# Altium project GameBoard_V1I1.PrjPcb (part 2 of 20)

## Sheet [05] - CPU - HDMI, LVDS.SchDoc
size A2; DocumentNumber: 5; SheetNumber: 5; SheetTotal: 32
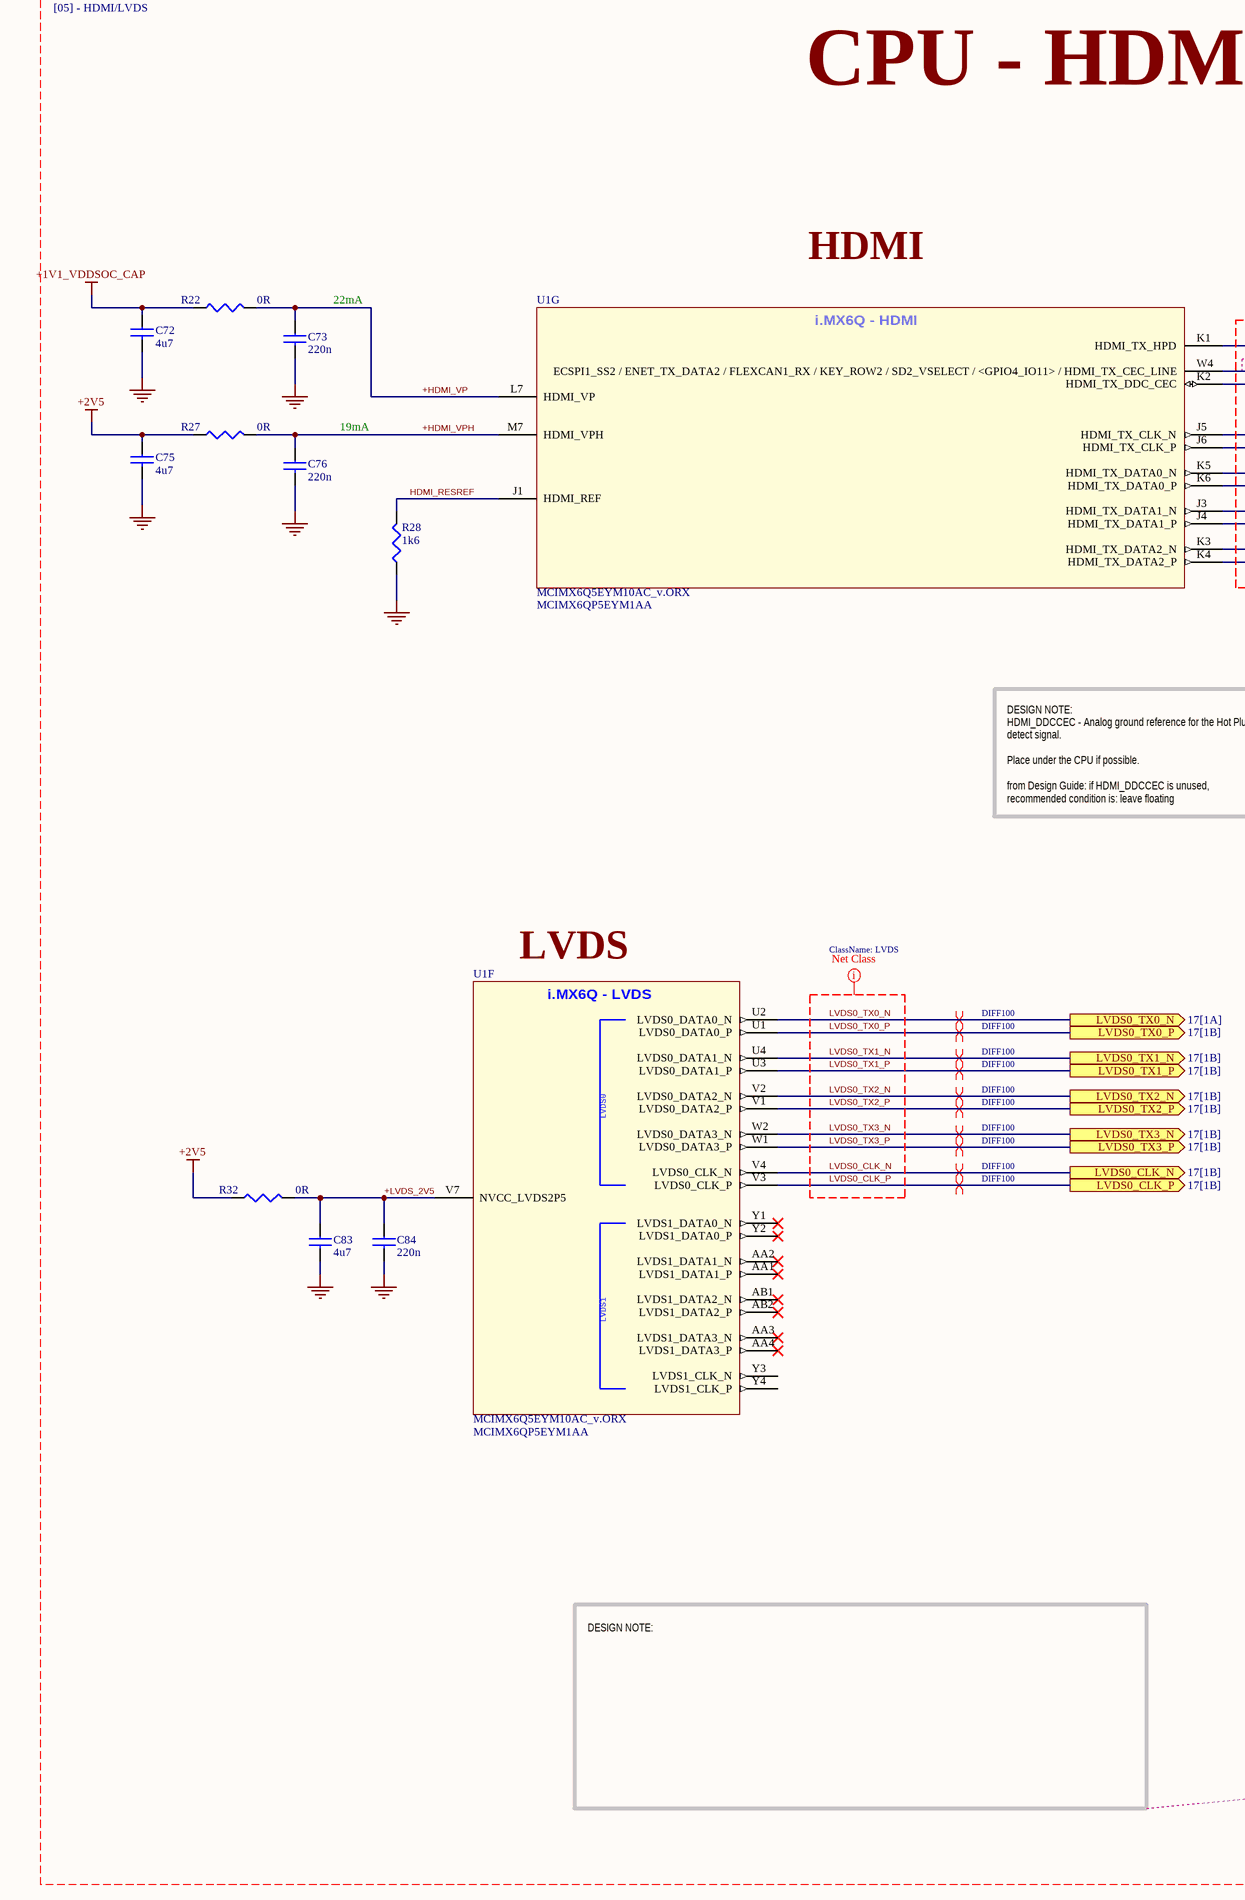
[diagram p12: [05] - CPU - HDMI, LVDS.SchDoc, left]
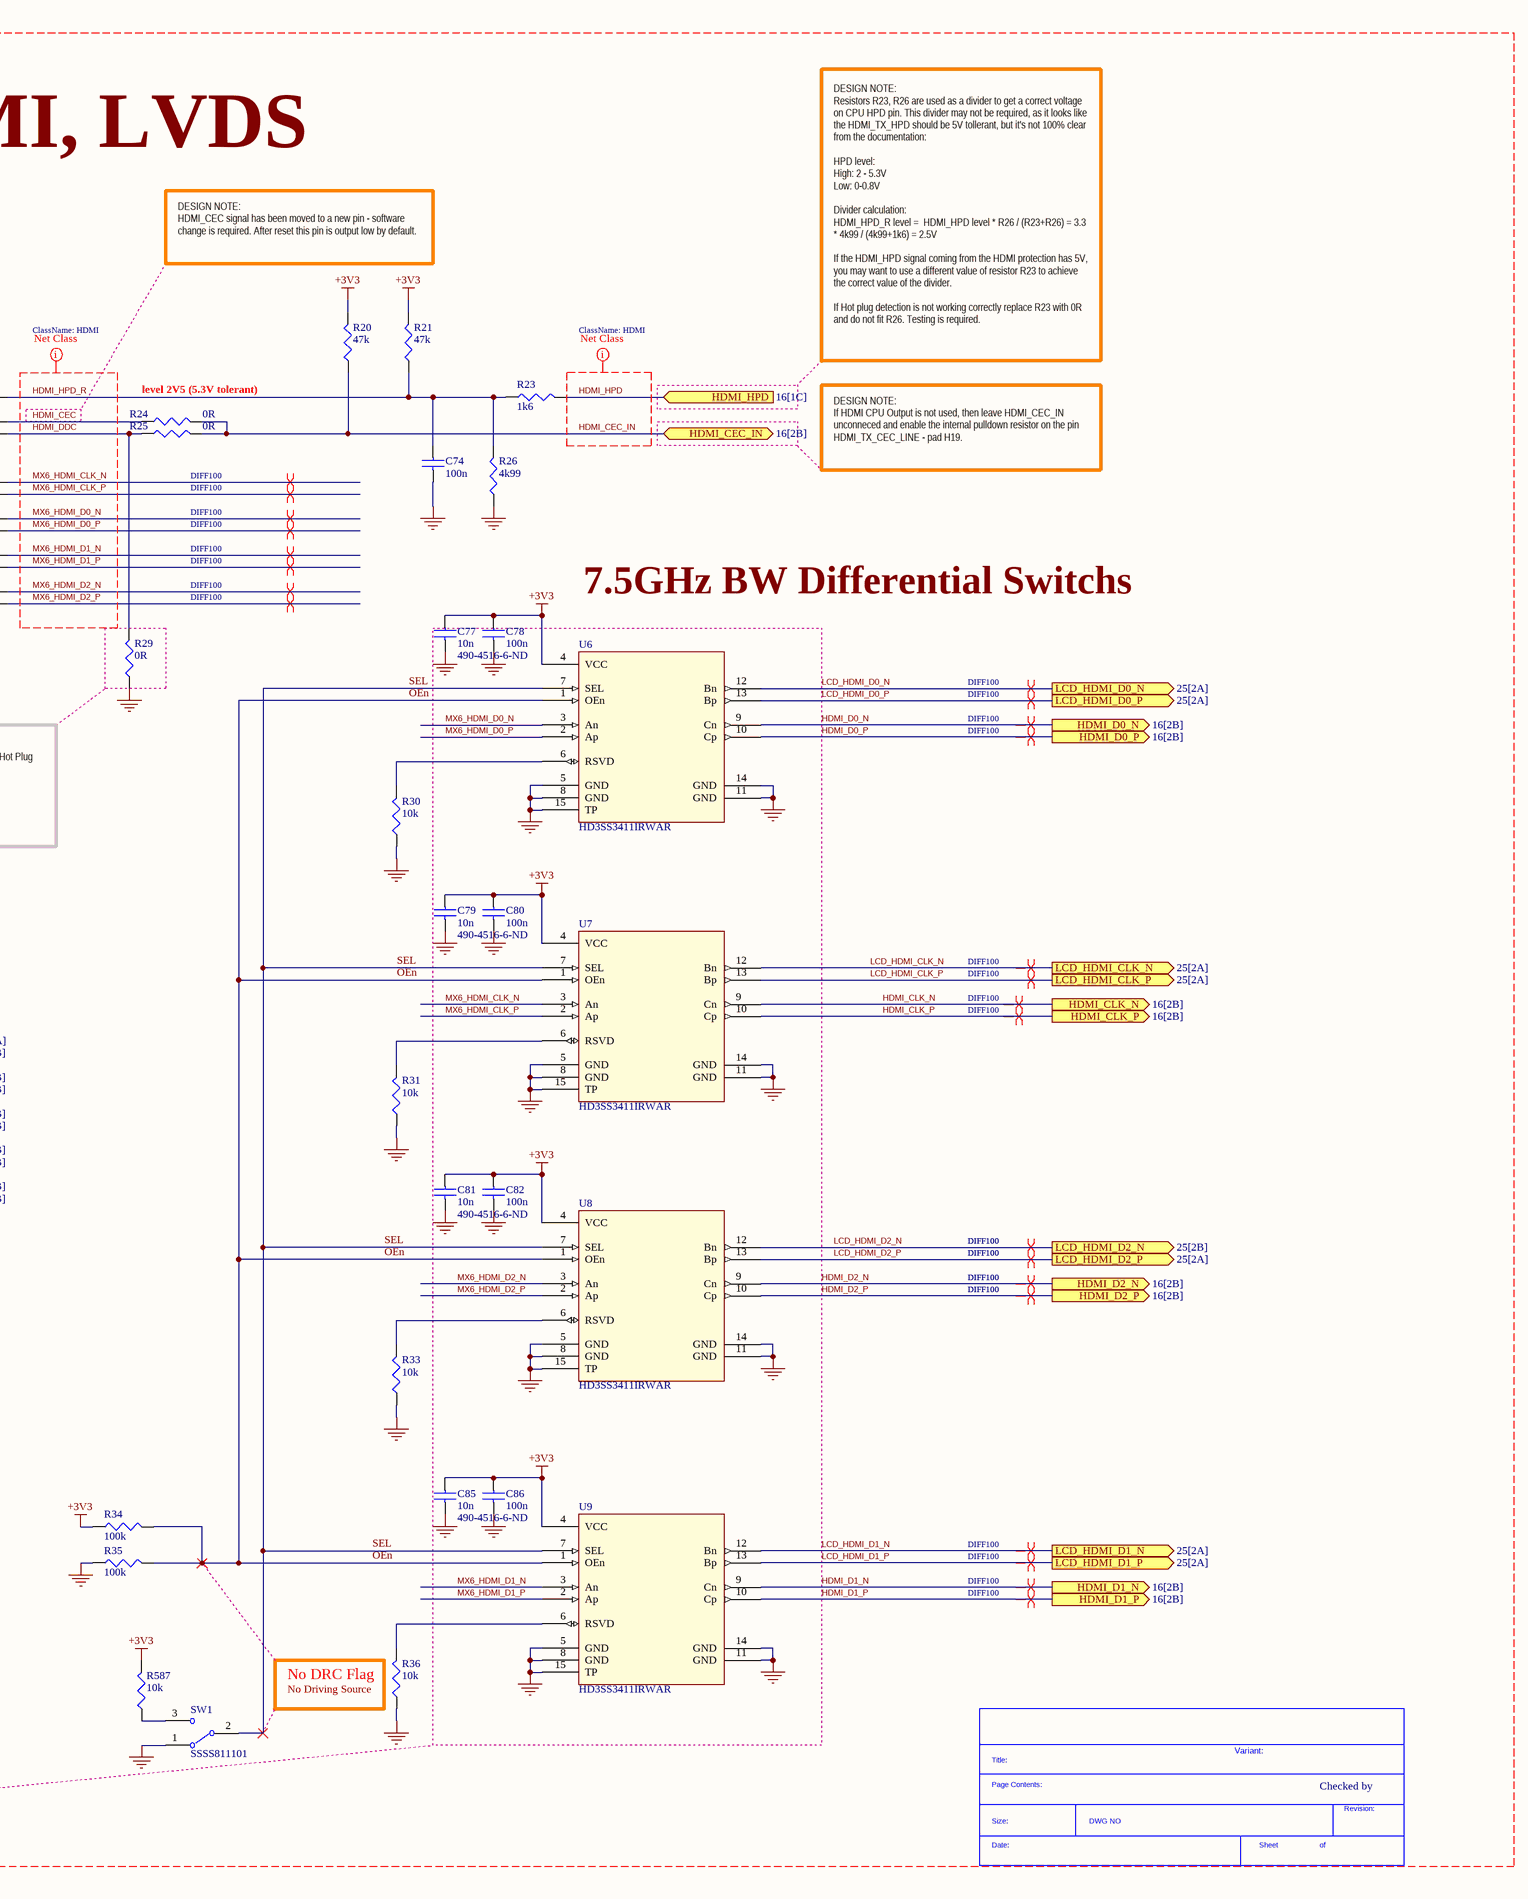
[diagram p13: [05] - CPU - HDMI, LVDS.SchDoc, right]

### Parts
(Parts that share a designator on the sheet are numbered #1, #2 ... from top to bottom, then left to right.)
*#6  SDTitleBlock  (value not drawn)  (graphical)
C72  4u7  [C0402]
C73  220n  [C0201]
C74  100n  [C0402]
C75  4u7  [C0402]
C76  220n  [C0201]
C77  10n  Supplier Part Number 2: 490-4516-6-ND  [C0402]
C78  100n  [C0402]
C79  10n  Supplier Part Number 2: 490-4516-6-ND  [C0402]
C80  100n  [C0402]
C81  10n  Supplier Part Number 2: 490-4516-6-ND  [C0402]
C82  100n  [C0402]
C83  4u7  [C0402]
C84  220n  [C0201]
C85  10n  Supplier Part Number 2: 490-4516-6-ND  [C0402]
C86  100n  [C0402]
R20  47k  [R0402]
R21  47k  [R0402]
R22  0R  [R0402]
R23  1k6  [R0402]
R24  0R  [R0402]
R25  0R  [R0402]
R26  4k99  [R0402]
R27  0R  [R0402]
R28  1k6  [R0201]
R29  0R  [R0402]
R30  10k  [R0201]
R31  10k  [R0201]
R32  0R  [R0402]
R33  10k  [R0201]
R34  100k  [R0402]
R35  100k  [R0402]
R36  10k  [R0201]
R587  10k  [R0201]
SW1  SSSS811101  [SSSS811101]
U1  MCIMX6Q5EYM10AC_v.ORX  Supplier Part Number 2: MCIMX6QP5EYM1AA  [PBGA624]  (parts F,G of 23)
U6  HD3SS3411IRWAR  [QFN50P330X330X80_HS-15N]
U7  HD3SS3411IRWAR  [QFN50P330X330X80_HS-15N]
U8  HD3SS3411IRWAR  [QFN50P330X330X80_HS-15N]
U9  HD3SS3411IRWAR  [QFN50P330X330X80_HS-15N]

### Ports
HDMI_CEC_IN (bidir, see 16[2B]), HDMI_CLK_N (out, see 16[2B]), HDMI_CLK_P (out, see 16[2B]), HDMI_D0_N (out, see 16[2B]), HDMI_D0_P (out, see 16[2B]), HDMI_D1_N (out, see 16[2B]), HDMI_D1_P (out, see 16[2B]), HDMI_D2_N (out, see 16[2B]), HDMI_D2_P (out, see 16[2B]), HDMI_HPD (in, see 16[1C]), LCD_HDMI_CLK_N (out, see 25[2A]), LCD_HDMI_CLK_P (out, see 25[2A]), LCD_HDMI_D0_N (out, see 25[2A]), LCD_HDMI_D0_P (out, see 25[2A]), LCD_HDMI_D1_N (out, see 25[2A]), LCD_HDMI_D1_P (out, see 25[2A]), LCD_HDMI_D2_N (out, see 25[2B]), LCD_HDMI_D2_P (out, see 25[2A]), LVDS0_CLK_N (out, see 17[1B]), LVDS0_CLK_P (out, see 17[1B]), LVDS0_TX0_N (out, see 17[1A]), LVDS0_TX0_P (out, see 17[1B]), LVDS0_TX1_N (out, see 17[1B]), LVDS0_TX1_P (out, see 17[1B]), LVDS0_TX2_N (out, see 17[1B]), LVDS0_TX2_P (out, see 17[1B]), LVDS0_TX3_N (out, see 17[1B]), LVDS0_TX3_P (out, see 17[1B])

### Nets
+1V1_VDDSOC_CAP: C72.1 R22.1
+2V5: C75.1 R27.1 R32.1
+3V3: C77.1 C78.1 C79.1 C80.1 C81.1 C82.1 C85.1 C86.1 R20.2 R21.2 R34.1 R587.2 U6.4(VCC) U7.4(VCC) U8.4(VCC) U9.4(VCC)
GND: C72.2 C73.2 C74.2 C75.2 C76.2 C77.2 C78.2 C79.2 C80.2 C81.2 C82.2 C83.2 C84.2 C85.2 C86.2 R26.1 R28.1 R29.1 R30.1 R31.1 R33.1 R35.1 R36.1 SW1.1 U6.5(GND) U6.8(GND) U6.11(GND) U6.14(GND) U6.15(TP) U7.5(GND) U7.8(GND) U7.11(GND) U7.14(GND) U7.15(TP) U8.5(GND) U8.8(GND) U8.11(GND) U8.14(GND) U8.15(TP) U9.5(GND) U9.8(GND) U9.11(GND) U9.14(GND) U9.15(TP)
+HDMI_VP: C73.1 R22.2 U1.L7(HDMI_VP)
+HDMI_VPH: C76.1 R27.2 U1.M7(HDMI_VPH)
+LVDS_2V5: C83.1 C84.1 R32.2 U1.V7(NVCC_LVDS2P5)
HDMI_CEC: R24.1 U1.W4(ECSPI1_SS2_/_ENET_TX_DATA2_/_FLEXCAN1_RX_/_KEY_ROW2_/_SD2_VSELECT_/_<GPIO4_IO11>_/_HDMI_TX_CEC_LINE)
HDMI_CEC_IN: R20.1 R24.2 R25.2 ; port HDMI_CEC_IN
HDMI_CLK_N: U7.9(Cn) ; port HDMI_CLK_N
HDMI_CLK_P: U7.10(Cp) ; port HDMI_CLK_P
HDMI_D0_N: U6.9(Cn) ; port HDMI_D0_N
HDMI_D0_P: U6.10(Cp) ; port HDMI_D0_P
HDMI_D1_N: U9.9(Cn) ; port HDMI_D1_N
HDMI_D1_P: U9.10(Cp) ; port HDMI_D1_P
HDMI_D2_N: U8.9(Cn) ; port HDMI_D2_N
HDMI_D2_P: U8.10(Cp) ; port HDMI_D2_P
HDMI_DDC: R25.1 R29.2 U1.K2(HDMI_TX_DDC_CEC)
HDMI_HPD: R23.2 ; port HDMI_HPD
HDMI_HPD_R: C74.1 R21.1 R23.1 R26.2 U1.K1(HDMI_TX_HPD)
HDMI_RESREF: R28.2 U1.J1(HDMI_REF)
LCD_HDMI_CLK_N: U7.12(Bn) ; port LCD_HDMI_CLK_N
LCD_HDMI_CLK_P: U7.13(Bp) ; port LCD_HDMI_CLK_P
LCD_HDMI_D0_N: U6.12(Bn) ; port LCD_HDMI_D0_N
LCD_HDMI_D0_P: U6.13(Bp) ; port LCD_HDMI_D0_P
LCD_HDMI_D1_N: U9.12(Bn) ; port LCD_HDMI_D1_N
LCD_HDMI_D1_P: U9.13(Bp) ; port LCD_HDMI_D1_P
LCD_HDMI_D2_N: U8.12(Bn) ; port LCD_HDMI_D2_N
LCD_HDMI_D2_P: U8.13(Bp) ; port LCD_HDMI_D2_P
LVDS0_CLK_N: U1.V4(LVDS0_CLK_N) ; port LVDS0_CLK_N
LVDS0_CLK_P: U1.V3(LVDS0_CLK_P) ; port LVDS0_CLK_P
LVDS0_TX0_N: U1.U2(LVDS0_DATA0_N) ; port LVDS0_TX0_N
LVDS0_TX0_P: U1.U1(LVDS0_DATA0_P) ; port LVDS0_TX0_P
LVDS0_TX1_N: U1.U4(LVDS0_DATA1_N) ; port LVDS0_TX1_N
LVDS0_TX1_P: U1.U3(LVDS0_DATA1_P) ; port LVDS0_TX1_P
LVDS0_TX2_N: U1.V2(LVDS0_DATA2_N) ; port LVDS0_TX2_N
LVDS0_TX2_P: U1.V1(LVDS0_DATA2_P) ; port LVDS0_TX2_P
LVDS0_TX3_N: U1.W2(LVDS0_DATA3_N) ; port LVDS0_TX3_N
LVDS0_TX3_P: U1.W1(LVDS0_DATA3_P) ; port LVDS0_TX3_P
MX6_HDMI_CLK_N: U1.J5(HDMI_TX_CLK_N) U7.3(An)
MX6_HDMI_CLK_P: U1.J6(HDMI_TX_CLK_P) U7.2(Ap)
MX6_HDMI_D0_N: U1.K5(HDMI_TX_DATA0_N) U6.3(An)
MX6_HDMI_D0_P: U1.K6(HDMI_TX_DATA0_P) U6.2(Ap)
MX6_HDMI_D1_N: U1.J3(HDMI_TX_DATA1_N) U9.3(An)
MX6_HDMI_D1_P: U1.J4(HDMI_TX_DATA1_P) U9.2(Ap)
MX6_HDMI_D2_N: U1.K3(HDMI_TX_DATA2_N) U8.3(An)
MX6_HDMI_D2_P: U1.K4(HDMI_TX_DATA2_P) U8.2(Ap)
OEn: R34.2 R35.2 U6.1(OEn) U7.1(OEn) U8.1(OEn) U9.1(OEn)
SEL: SW1.2 U6.7(SEL) U7.7(SEL) U8.7(SEL) U9.7(SEL)
NetR30_2: R30.2 U6.6(RSVD)
NetR31_2: R31.2 U7.6(RSVD)
NetR33_2: R33.2 U8.6(RSVD)
NetR36_2: R36.2 U9.6(RSVD)
NetR587_1: R587.1 SW1.3

Not connected (* = marked no-connect by the designer): U1 AA1(LVDS1_DATA1_P)* AA2(LVDS1_DATA1_N)* AA3(LVDS1_DATA3_N)* AA4(LVDS1_DATA3_P)* AB1(LVDS1_DATA2_N)* AB2(LVDS1_DATA2_P)* Y1(LVDS1_DATA0_N)* Y2(LVDS1_DATA0_P)* Y3(LVDS1_CLK_N) Y4(LVDS1_CLK_P)

### Layout directives
differential pair; net class DIFF100: HDMI_CLK_N, HDMI_CLK_P, HDMI_D0_N, HDMI_D0_P, HDMI_D1_N, HDMI_D1_P, HDMI_D2_N, HDMI_D2_P, LCD_HDMI_CLK_N, LCD_HDMI_CLK_P, LCD_HDMI_D0_N, LCD_HDMI_D0_P, LCD_HDMI_D1_N, LCD_HDMI_D1_P, LCD_HDMI_D2_N, LCD_HDMI_D2_P, LVDS0_CLK_N, LVDS0_CLK_P, LVDS0_TX0_N, LVDS0_TX0_P, LVDS0_TX1_N, LVDS0_TX1_P, LVDS0_TX2_N, LVDS0_TX2_P, LVDS0_TX3_N, LVDS0_TX3_P, MX6_HDMI_CLK_N, MX6_HDMI_CLK_P, MX6_HDMI_D0_N, MX6_HDMI_D0_P, MX6_HDMI_D1_N, MX6_HDMI_D1_P, MX6_HDMI_D2_N, MX6_HDMI_D2_P
net class HDMI: HDMI_CEC, HDMI_CEC_IN, HDMI_DDC, HDMI_HPD, HDMI_HPD_R, MX6_HDMI_CLK_N, MX6_HDMI_CLK_P, MX6_HDMI_D0_N, MX6_HDMI_D0_P, MX6_HDMI_D1_N, MX6_HDMI_D1_P, MX6_HDMI_D2_N, MX6_HDMI_D2_P
net class [05] - HDMI/LVDS: +1V1_VDDSOC_CAP, +2V5, +3V3, +HDMI_VP, +HDMI_VPH, +LVDS_2V5, GND, HDMI_CEC, HDMI_CEC_IN, HDMI_CLK_N, HDMI_CLK_P, HDMI_D0_N, HDMI_D0_P, HDMI_D1_N, HDMI_D1_P, HDMI_D2_N, HDMI_D2_P, HDMI_DDC, HDMI_HPD, HDMI_HPD_R, HDMI_RESREF, LCD_HDMI_CLK_N, LCD_HDMI_CLK_P, LCD_HDMI_D0_N, LCD_HDMI_D0_P, LCD_HDMI_D1_N, LCD_HDMI_D1_P, LCD_HDMI_D2_N, LCD_HDMI_D2_P, LVDS0_CLK_N, LVDS0_CLK_P, LVDS0_TX0_N, LVDS0_TX0_P, LVDS0_TX1_N, LVDS0_TX1_P, LVDS0_TX2_N, LVDS0_TX2_P, LVDS0_TX3_N, LVDS0_TX3_P, MX6_HDMI_CLK_N, MX6_HDMI_CLK_P, MX6_HDMI_D0_N, MX6_HDMI_D0_P, MX6_HDMI_D1_N, MX6_HDMI_D1_P, MX6_HDMI_D2_N, MX6_HDMI_D2_P, OEn, SEL
net class LVDS: LVDS0_CLK_N, LVDS0_CLK_P, LVDS0_TX0_N, LVDS0_TX0_P, LVDS0_TX1_N, LVDS0_TX1_P, LVDS0_TX2_N, LVDS0_TX2_P, LVDS0_TX3_N, LVDS0_TX3_P

### Notes on the sheet
- CPU - HDMI, LVDS
- DESIGN NOTE:
  HDMI_CEC signal has been moved to a new pin - software change is required. After reset this pin is output low by default.
- HDMI
- (near C73) 22mA
- level 2V5 (5.3V tolerant)
- DESIGN NOTE:
  Resistors R23, R26 are used as a divider to get a correct voltage on CPU HPD pin. This divider may not be required, as it looks like the HDMI_TX_HPD should be 5V tollerant, but it's not 100% clear from the documentation:
  HPD level:
  High: 2 - 5.3V
  Low: 0-0.8V
  Divider calculation:
  HDMI_HPD_R level =  HDMI_HPD level * R26 / (R23+R26) = 3.3 * 4k99 / (4k99+1k6) = 2.5V
  If the HDMI_HPD signal coming from the HDMI protection has 5V, you may want to use a different value of resistor R23 to achieve the correct value of the divider.
  If Hot plug detection is not working correctly replace R23 with 0R and do not fit R26. Testing is required.
- DESIGN NOTE:
  If HDMI CPU Output is not used, then leave HDMI_CEC_IN unconneced and enable the internal pulldown resistor on the pin HDMI_TX_CEC_LINE - pad H19.
- 19mA
- 7.5GHz BW Differential Switchs
- DESIGN NOTE:
  HDMI_DDCCEC - Analog ground reference for the Hot Plug detect signal.
  Place under the CPU if possible.
  from Design Guide: if HDMI_DDCCEC is unused, recommended condition is: leave floating
- LVDS
- DESIGN NOTE:
- (near R36) No DRC Flag
- (near R36) No Driving Source
- Variant:
- Checked by
- (in symbol MCIMX6Q5EYM10AC_v.ORX, part F) i.MX6Q - LVDS; LVDS0; LVDS1
- (in symbol MCIMX6Q5EYM10AC_v.ORX, part G) i.MX6Q - HDMI
- (in symbol SDTitleBlock) Title:; Page Contents:; Revision:; Size:; DWG NO; Date:; Sheet; of

### Library data of the parts
C72 C75 C83 = C1005X5R1A475M: as C60 on sheet [04] - CPU - PCIE, USB; Supplier 1: Digi-Key; Supplier Part Number 1: 445-8023-1-ND; Manufacturer Part Number: C1005X5R1A475M; RoHS: RoHS Compliant; Category: Capacitors; Stock 1: 10140; Pricing 1: 1=0.53, 10=0.415, 100=0.25, 250=0.18752, 500=0.16, 1000=0.125, 5000=0.095 (USD); Voltage - Rated: 10V; Tolerance: ±20%; Temperature Coefficient: X5R; Mounting Type: Surface Mount, MLCC; Operating Temperature: -55°C ~ 85°C; Applications: General Purpose; Ratings: -; Package / Case: 0402 (1005 Metric); Size / Dimension: 0.039" L x 0.020" W (1.00mm x 0.50mm); Height - Seated (Max): -; Thickness (Max): -; Lead Spacing: -; Features: -; Packaging: Cut Tape (CT); Lead Style: -; ComponentLink1URL: http://www.tdk.com/pdf/general_B11.pdf; ComponentLink1Description: http://www.tdk.com/pdf/general_B11.pdf; .Checked SCH: used
C73 C76 C84 = C0603X5R0J224M030BB: as C59 on sheet [04] - CPU - PCIE, USB; Supplier 1: Digi-Key; Manufacturer Part Number: C0603X5R0J224M030BB; RoHS: RoHS Compliant; Category: Capacitors; Stock 1: 205900; Pricing 1: 1=0.15, 10=0.102, 100=0.0485, 250=0.0408, 500=0.03418, 1000=0.0275, 5000=0.02325 (USD); Packaging: Cut Tape (CT); Tolerance: ±20%; Voltage - Rated: 6.3V; Temperature Coefficient: X5R; Mounting Type: Surface Mount, MLCC; Operating Temperature: -55°C ~ 85°C; Applications: General Purpose; Ratings: -; Package / Case: 0201 (0603 Metric); Size / Dimension: 0.024" L x 0.012" W (0.60mm x 0.30mm); Height - Seated (Max): -; Thickness (Max): 0.013" (0.33mm); Lead Spacing: -; Features: -; Lead Style: -; ComponentLink1URL: http://product.tdk.com/en/catalog/datasheets/mlcc_commercial_general_en.pdf; ComponentLink1Description: http://product.tdk.com/en/catalog/datasheets/mlcc_commercial_general_en.pdf; Supplier Part Number 1: 445-5929-1-ND; .Checked SCH: used; Supplier 2: Digi-Key; Supplier Part Number 2: 1276-1042-6-ND
C74 C78 C80 C82 C86 = C1005X5R1H104K: as C476 on sheet [17] - LVDS, CSI; Category: Capacitors; Supplier Part Number: 445-5942-1-ND; Manufacturer Part Number: C1005X5R1H104K; Operating Temperature: -55°C ~ 85°C; Package / Case: 0402 (1005 Metric); Price 1k [$]: 0.02340; .Checked SCH: used; Voltage - Rated: 50V; Supplier: Digikey; Supplier 1: Digi-Key; Supplier Part Number 1: 445-5942-1-ND; RoHS: RoHS Compliant; Stock 1: 106926; Pricing 1: 1=0.27, 10=0.18, 100=0.072, 250=0.05176, 500=0.0369, 1000=0.027 (USD); Tolerance: ±10%; Temperature Coefficient: X5R; Mounting Type: Surface Mount, MLCC; Applications: General Purpose; Ratings: -; Size / Dimension: 0.039" L x 0.020" W (1.00mm x 0.50mm); Height - Seated (Max): -; Thickness (Max): 0.022" (0.55mm); Lead Spacing: -; Features: -; Packaging: Cut Tape (CT); Lead Style: -; ComponentLink1URL: http://www.tdk.co.jp/tefe02/e412_c.pdf; ComponentLink1Description: http://www.tdk.co.jp/tefe02/e412_c.pdf; Supplier 2: Digi-Key; Supplier Part Number 2: 311-1697-6-ND
C77 C79 C81 C85 = C1005X7R1H103K: CAP CER 10000PF 50V 10% X7R 0402; Manufacturer: TDK Corporation; Value: 10nF; .Checked PCB: used; Capacitance: 10000pF; Category: Capacitors; Supplier Part Number: 445-6850-1-ND; Manufacturer Part Number: C1005X7R1H103K; Operating Temperature: -55°C ~ 125°C; Package / Case: 0402 (1005 Metric); Price 1k [$]: 0.01625; .Checked SCH: used; Voltage - Rated: 50V; Supplier: Digikey; Supplier 1: Digi-Key; Supplier Part Number 1: 445-6850-1-ND; RoHS: RoHS Compliant; Stock 1: 3901; Pricing 1: 1=0.2, 10=0.125, 100=0.045, 250=0.03252, 500=0.024, 1000=0.01625 (USD); Tolerance: ±10%; Temperature Coefficient: X7R; Mounting Type: Surface Mount, MLCC; Applications: General Purpose; Ratings: -; Size / Dimension: 0.039" L x 0.020" W (1.00mm x 0.50mm); Height - Seated (Max): -; Thickness (Max): 0.022" (0.55mm); Lead Spacing: -; Features: -; Packaging: Cut Tape (CT); Lead Style: -; ComponentLink1URL: http://www.tdk.co.jp/tefe02/e412_c.pdf; ComponentLink1Description: http://www.tdk.co.jp/tefe02/e412_c.pdf; Supplier 2: Digi-Key
R20 R21 = RC0402FR-0747KL: RES 47.0K OHM 1/16W 1% 0402 SMD; Manufacturer: Yageo; Power (Watts): 0.063W, 1/16W; .Checked PCB: used; Temperature Coefficient: ±100ppm/°C; Category: Resistors; Supplier Part Number: 311-47.0KLRCT-ND; Manufacturer Part Number: RC0402FR-0747KL; Package / Case: 0402 (1005 Metric); Price 1k [$]: 0.01421; Resistance (Ohms): 47K; Tolerance: ±1%; Value: 47k; .Checked SCH: used; Supplier: Digikey; Supplier 1: Digi-Key; Supplier Part Number 1: 311-47.0KLRCT-ND; RoHS: RoHS Compliant; Stock 1: 1227580; Pricing 1: 10=0.014, 50=0.0104, 100=0.0079, 250=0.00584, 500=0.00432, 1000=0.00288 (USD); Composition: Thick Film; Features: -; Size / Dimension: 0.039" L x 0.020" W (1.00mm x 0.50mm); Height: 0.016" (0.40mm); Number of Terminations: 2; Packaging: Cut Tape (CT); ComponentLink1URL: http://www.yageo.com/documents/recent/PYu-RC0402_51_RoHS_L_6.pdf; ComponentLink1Description: http://www.yageo.com/documents/recent/PYu-RC0402_51_RoHS_L_6.pdf; Supplier 2: Digi-Key; Supplier Part Number 2: 1276-3467-1-ND
R22 R24 R25 R27 R29 R32 = RC0402JR-070RL: as R443 on sheet [17] - LVDS, CSI; Category: Resistors; Supplier Part Number: 311-0.0JRCT-ND; Manufacturer Part Number: RC0402JR-070RL; Package / Case: 0402 (1005 Metric); Price 1k [$]: 0.01389; Value: 0R; .Checked SCH: used; Supplier: Digikey; Supplier 1: Digi-Key; Supplier Part Number 1: 311-0.0JRCT-ND; RoHS: RoHS Compliant; Stock 1: 1106330; Pricing 1: 10=0.012, 50=0.009, 100=0.0069, 250=0.00512, 500=0.0038, 1000=0.00253 (USD); Composition: Thick Film; Features: -; Temperature Coefficient: -; Size / Dimension: 0.039" L x 0.020" W (1.00mm x 0.50mm); Height: 0.016" (0.40mm); Number of Terminations: 2; Packaging: Cut Tape (CT); ComponentLink1URL: http://www.yageo.com/documents/recent/PYu-RC0402_51_RoHS_L_6.pdf; ComponentLink1Description: http://www.yageo.com/documents/recent/PYu-RC0402_51_RoHS_L_6.pdf
R23 = ERJ-2RKF1601X: RES 1.6K OHM 1/10W 1% 0402 SMD; Manufacturer: Panasonic Electronic Components; Power (Watts): 0.1W, 1/10W; Temperature Coefficient: ±100ppm/°C; .Creator: MM; .Checked PCB: used; Supplier 1: Digi-Key; Manufacturer Part Number: ERJ-2RKF1601X; RoHS: RoHS Compliant; Category: Resistors; Stock 1: 89488; Pricing 1: 1=0.1, 50=0.0242, 100=0.0184, 250=0.01364, 500=0.01008, 1000=0.00672, 5000=0.00473 (USD); Resistance (Ohms): 1.6k; Composition: Thick Film; Features: -; Tolerance: ±1%; Package / Case: 0402 (1005 Metric); Supplier Device Package: 0402; Size / Dimension: 0.039" L x 0.020" W (1.00mm x 0.50mm); Height: 0.016" (0.40mm); Number of Terminations: 2; Packaging: Cut Tape (CT); ComponentLink1URL: http://industrial.panasonic.com/www-cgi/jvcr13pz.cgi?E+PZ+3+AOA0002+ERJ2RKF1601X+7+WW; ComponentLink1Description: http://industrial.panasonic.com/www-cgi/jvcr13pz.cgi?E+PZ+3+AOA0002+ERJ2RKF1601X+7+WW; Supplier Part Number 1: P1.60KLCT-ND; .Checked SCH: used
R26 = RMCF0402FT4K99: RES TF 4.99K OHM 1% 1/16W 0402; Manufacturer: Stackpole Electronics Inc; Power (Watts): 0.063W, 1/16W; .Checked PCB: used; Temperature Coefficient: ±100ppm/°C; Category: Resistors; Supplier Part Number: RMCF0402FT4K99CT-ND; Manufacturer Part Number: RMCF0402FT4K99; Package / Case: 0402 (1005 Metric); Price 1k [$]: 0.00384; Resistance (Ohms): 4.99K; Tolerance: ±1%; Value: 4k99; .Checked SCH: used; Supplier: Digikey; Supplier 1: Digi-Key; Supplier Part Number 1: RMCF0402FT4K99CT-ND; RoHS: RoHS Compliant; Stock 1: 48509; Pricing 1: 1=0.04, 10=0.025, 50=0.0138, 100=0.0105, 250=0.0078, 500=0.00576, 1000=0.00384 (USD); Composition: Thick Film; Features: -; Size / Dimension: 0.039" L x 0.020" W (1.00mm x 0.50mm); Height: 0.016" (0.40mm); Number of Terminations: 2; Packaging: Cut Tape (CT); ComponentLink1URL: http://www.seielect.com/Catalog/SEI-RMCF.pdf; ComponentLink1Description: http://www.seielect.com/Catalog/SEI-RMCF.pdf
R28 = CRCW02011K60FKED: RES 1.60K OHM 1/20W 1% 0201 SMD; Manufacturer: Vishay Dale; Resistance (Ohms): 1.6k; Power (Watts): 0.05W, 1/20W; Temperature Coefficient: ±100ppm/°C; .Creator: MM; .Checked PCB: used; Supplier 1: Digi-Key; Manufacturer Part Number: CRCW02011K60FKED; RoHS: RoHS Compliant; Category: Resistors; Stock 1: 31501; Pricing 1: 1=0.26, 10=0.218, 25=0.1584, 50=0.1148, 100=0.0851, 250=0.06536, 500=0.05148, 1000=0.03564, 2500=0.03267 (USD); Packaging: Cut Tape (CT); Tolerance: ±1%; Composition: Thick Film; Features: -; Package / Case: 0201 (0603 Metric); Supplier Device Package: 0201 (0603 Metric); Size / Dimension: 0.024" L x 0.012" W (0.60mm x 0.30mm); Height: 0.011" (0.28mm); Number of Terminations: 2; ComponentLink1URL: http://www.vishay.com/docs/20052/crcw0201e3.pdf; ComponentLink1Description: http://www.vishay.com/docs/20052/crcw0201e3.pdf; Supplier Part Number 1: 541-1.60KAABCT-ND; .Checked SCH: used
R30 R31 R33 R36 R587 = RC0201FR-0710KL: RES 10K OHM 1/20W 1% 0201 SMD; Manufacturer: Yageo; Power (Watts): 0.05W, 1/20W; Temperature Coefficient: ±200ppm/°C; .Creator: MM; .Checked PCB: used; Supplier 1: Digi-Key; Manufacturer Part Number: RC0201FR-0710KL; RoHS: RoHS Compliant; Category: Resistors; Stock 1: 529049; Pricing 1: 1=0.1, 10=0.074, 25=0.054, 100=0.0303, 250=0.02312, 500=0.0185, 1000=0.01361, 2500=0.01182, 5000=0.00976 (USD); Packaging: Cut Tape (CT); Resistance (Ohms): 10k; Tolerance: ±1%; Composition: Thick Film; Features: Moisture Resistant; Package / Case: 0201 (0603 Metric); Supplier Device Package: 0201; Size / Dimension: 0.024" L x 0.012" W (0.60mm x 0.30mm); Height: 0.010" (0.26mm); Number of Terminations: 2; ComponentLink1URL: http://www.yageo.com/documents/recent/PYu-RC0201_51_RoHS_L_8.pdf; ComponentLink1Description: http://www.yageo.com/documents/recent/PYu-RC0201_51_RoHS_L_8.pdf; Supplier Part Number 1: 311-10.0KMCT-ND; .Checked SCH: used; Supplier 2: Digi-Key; Supplier Part Number 2: 541-10.0KABCT-ND
R34 R35 = RMCF0402FT100K: as R625 on sheet [04] - CPU - PCIE, USB; Category: Resistors; Supplier Part Number: RMCF0402FT100KCT-ND; Manufacturer Part Number: RMCF0402FT100K; Package / Case: 0402 (1005 Metric); Price 1k [$]: 0.00384; Resistance (Ohms): 100K; Tolerance: ±1%; Value: 100k; .Checked SCH: used; Supplier: Digikey; Supplier 1: Digi-Key; Supplier Part Number 1: YAG1343DKR-ND; RoHS: RoHS Compliant; Composition: Thick Film; Features: -; Size / Dimension: 0.039" L x 0.020" W (1.00mm x 0.50mm); Height: 0.016" (0.40mm); Number of Terminations: 2; Packaging: Cut Tape (CT); ComponentLink1URL: http://www.seielect.com/Catalog/SEI-RMCF.pdf; ComponentLink1Description: http://www.seielect.com/Catalog/SEI-RMCF.pdf
SW1 = SSSS811101: Slide Switches SPDT HORZ GRND 1.5mm; Manufacturer: Alps Electric; Mechanical Life: 10000Cycles; Throw Configuration: SP,SPDT; Max Voltage Rating (DC): 5V; Contact Current Rating: 300mA; Voltage Rating (AC): 4V; Contact Resistance: 70mR; Supplier 1: Mouser; Manufacturer Part Number: SSSS811101; Stock 1: 37406; Pricing 1: 1=0.97, 10=0.97, 50=0.819, 100=0.726, 1000=0.533, 10000=0.502 (USD); Mount: Surface Mount; Case/Package: SMD/SMT; Min Operating Temperature: -10°C; Max Operating Temperature: 85°C; Termination: Gull Wing; Packaging: Tape and Reel; Electrical Life: 10000Cycles; Orientation: Right Angle; Length: 7.7mm; Depth: 5mm; Radiation Hardening: No; Lead Free: Lead Free; ComponentLink1URL: https://datasheet.ciiva.com/18147/getdatasheetpartid-652127-18147399.pdf; ComponentLink1Description: https://datasheet.ciiva.com/18147/getdatasheetpartid-652127-18147399.pdf; ComponentLink2URL: https://datasheet.ciiva.com/16174/623ssss8-16174702.pdf; ComponentLink2Description: https://datasheet.ciiva.com/16174/623ssss8-16174702.pdf; .Checked PCH: *; .Checked SCH: *; .Creator: *; Supplier Part Number 1: 688-SSSS811101
U1 = MCIMX6Q5EYM10AC_v.ORX: as U1 on sheet [04] - CPU - PCIE, USB; Supplier 1: Digi-Key; Manufacturer Part Number: MCIMX6Q5EYM10AC; RoHS: RoHS Compliant; Category: Integrated Circuits (ICs); Stock 1: 0; Pricing 1: 1=54.98, 10=51.922, 25=48.868, 100=30.5424 (USD); Packaging: Tray; Package / Case: 624-FBGA, FCBGA; ComponentLink1URL: http://cache.freescale.com/files/32bit/doc/data_sheet/IMX6DQCEC.pdf; ComponentLink1Description: Data Sheet; Supplier Part Number 1: MCIMX6Q5EYM10AC-ND; .Checked SCH: used; Program Memory Size: -; EEPROM Size: -; Data Converters: -; Operating Temperature: -20°C ~ 105°C; ComponentLink2Description: User Guide; ComponentLink2URL: file:///C:/Users/mbeach/Downloads/i.MX_Linux_User's_Guide.pdf; Supplier 2: Arrow
U6-U9 = HD3SS3411IRWAR: IC MUX 2:1 8 OHM 14WQFN; Manufacturer: Texas Instruments; On-State Resistance (Max): 8 Ohm; Channel-to-Channel Matching (&Delta;Ron): 500 mOhm (Max); Voltage - Supply, Single (V+): 3 V ~ 3.6 V; -3db Bandwidth: 7.5GHz; Crosstalk: -35dB @ 4Ghz; Supplier 1: Digi-Key; Manufacturer Part Number: HD3SS3411IRWAR; RoHS: RoHS Compliant; Category: Integrated Circuits (ICs); Stock 1: 260; Pricing 1: 1=2.01, 10=1.801, 100=1.448, 500=1.18966, 1000=0.98571 (USD); Packaging: Cut Tape (CT); Part Status: Active; Switch Circuit: -; Multiplexer/Demultiplexer Circuit: 2:1; Voltage - Supply, Dual (V±): -; Switch Time (Ton, Toff) (Max): -; Charge Injection: -; Channel Capacitance (CS(off), CD(off)): -; Current - Leakage (IS(off)) (Max): -; Operating Temperature: -40°C ~ 105°C (TA); Package / Case: 14-WFQFN Exposed Pad; Supplier Device Package: 14-WQFN (3.5x3.5); ComponentLink1URL: http://www.ti.com/lit/ds/symlink/hd3ss3411.pdf; ComponentLink1Description: http://www.ti.com/lit/ds/symlink/hd3ss3411.pdf; Supplier Part Number 1: 296-43743-1-ND

## Sheet [06] - CPU - ETHERNET, SATA.SchDoc
size A2; DocumentNumber: 6; SheetNumber: 6; SheetTotal: 32
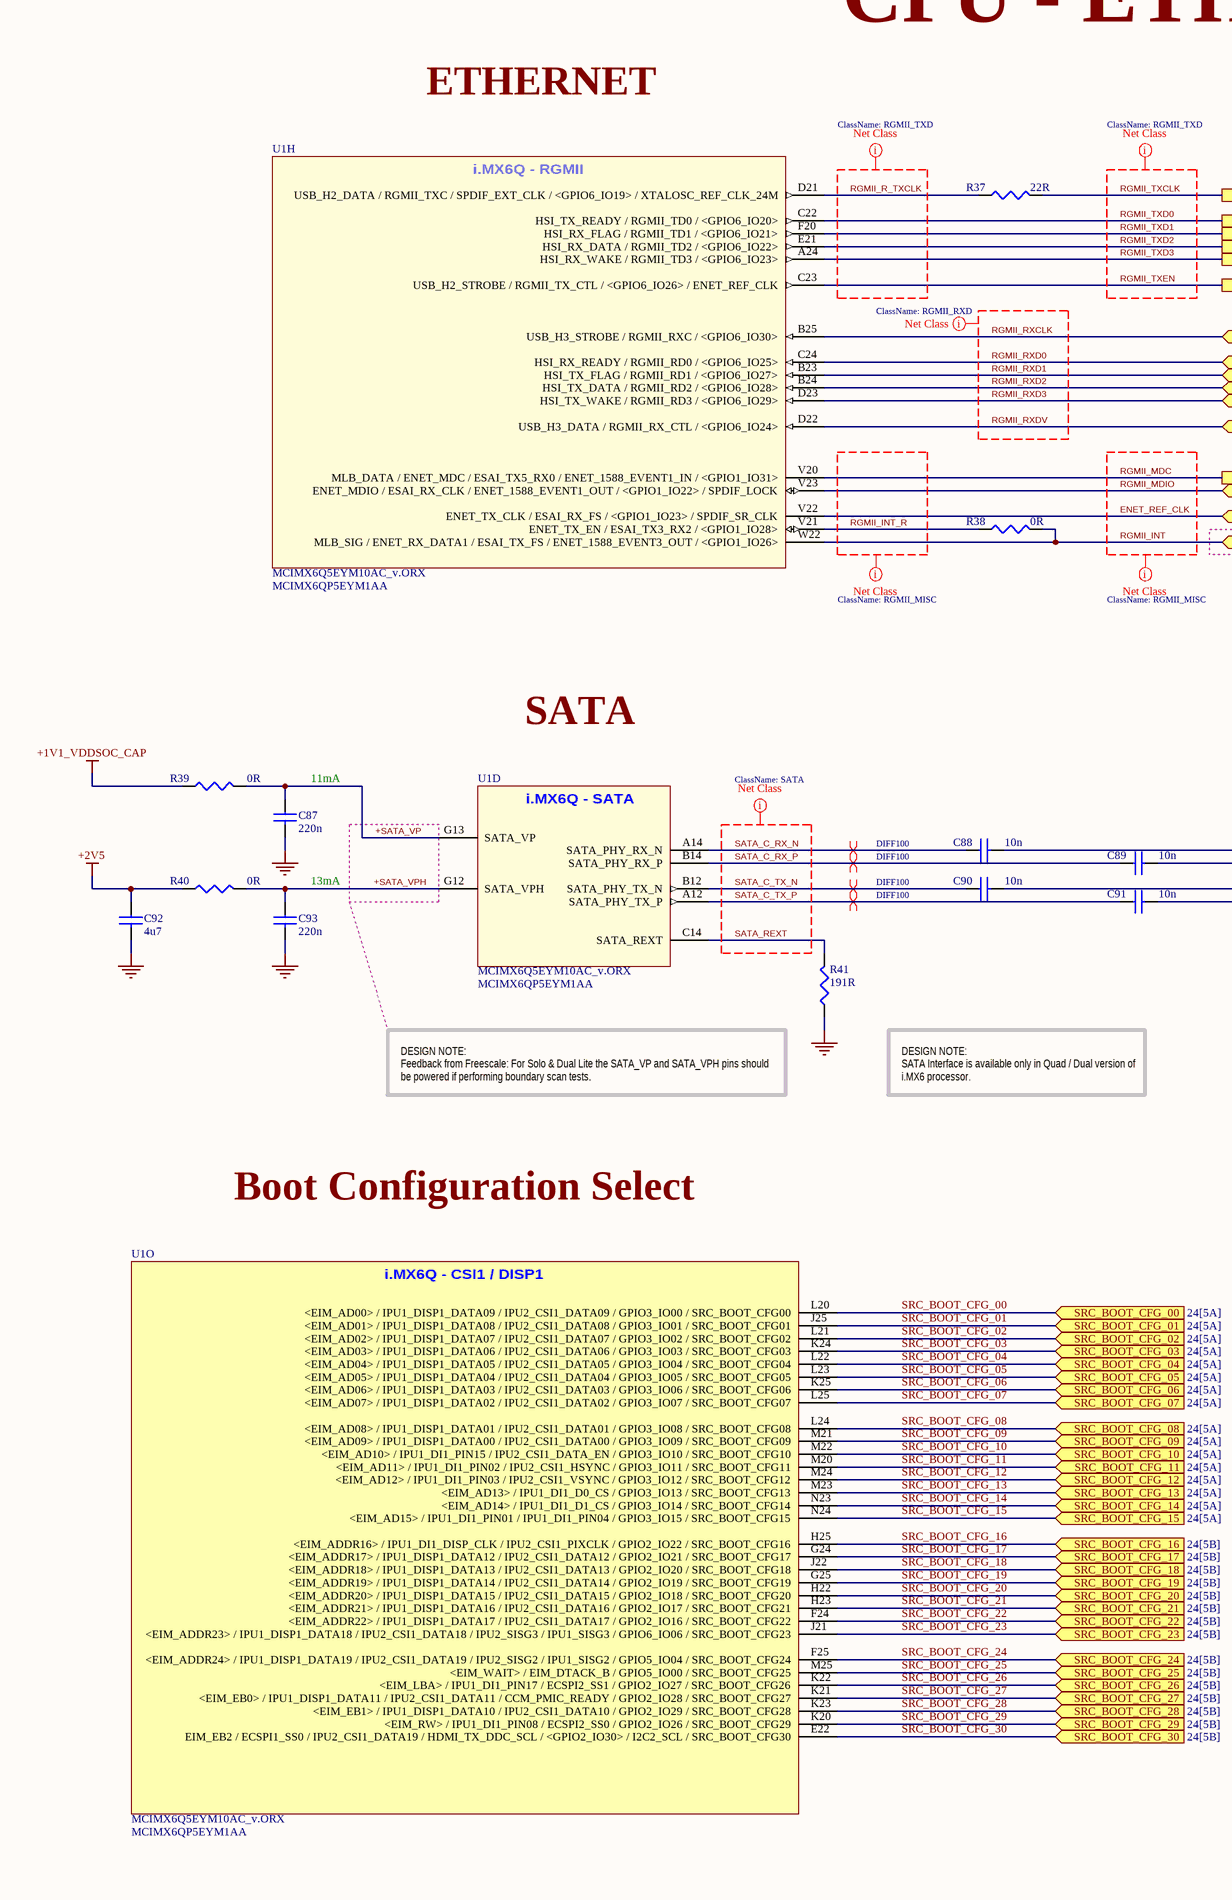
[diagram p14: [06] - CPU - ETHERNET, SATA.SchDoc, left]
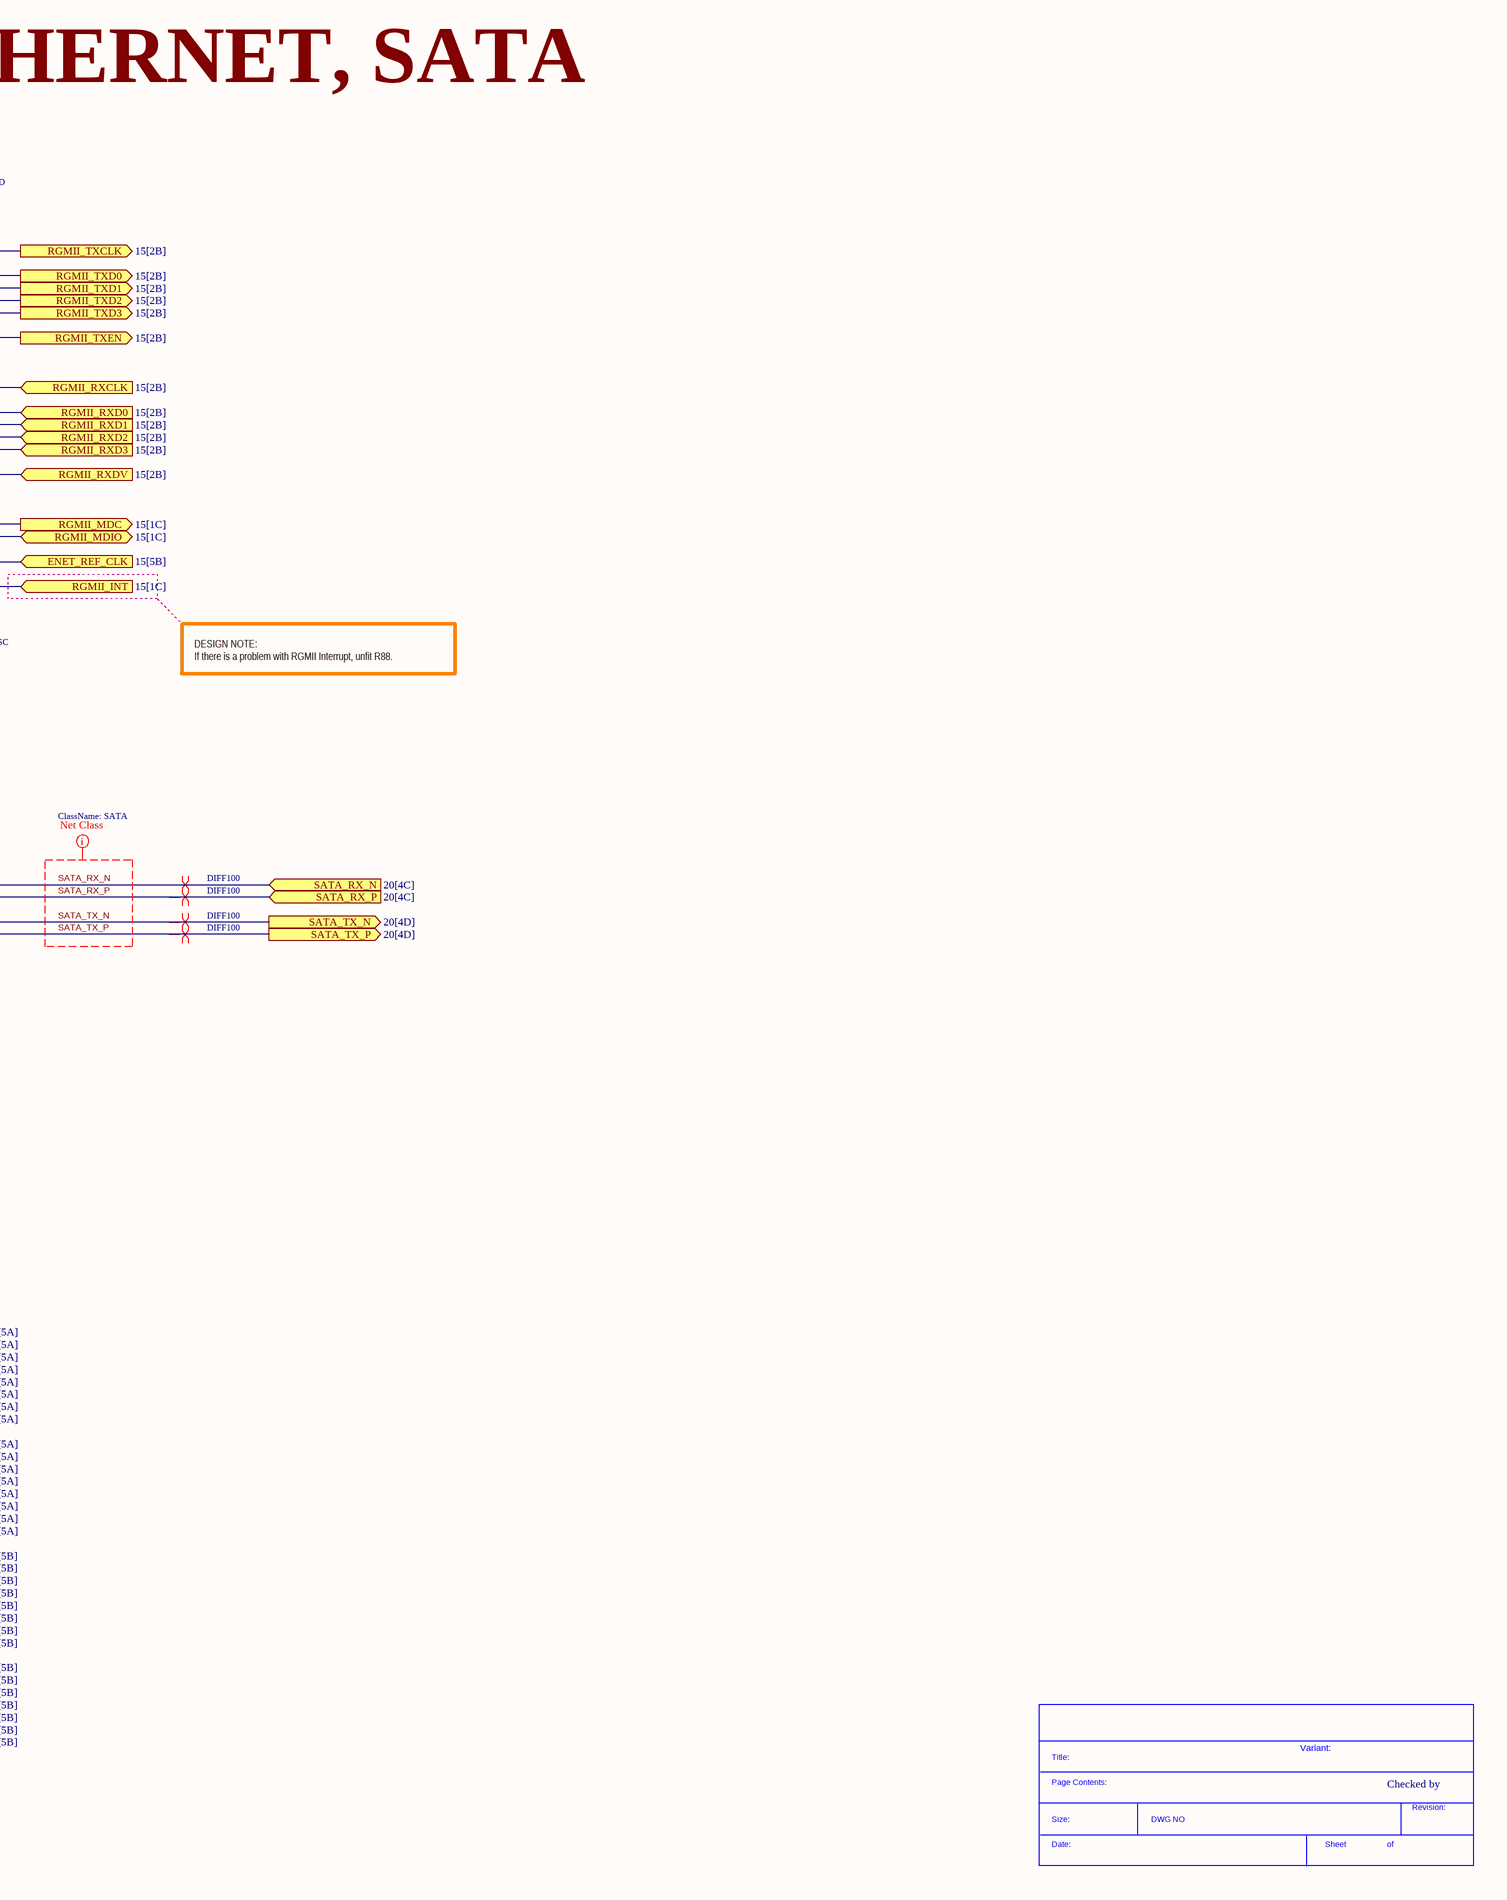
[diagram p15: [06] - CPU - ETHERNET, SATA.SchDoc, right]

### Parts
(Parts that share a designator on the sheet are numbered #1, #2 ... from top to bottom, then left to right.)
*#7  SDTitleBlock  (value not drawn)  (graphical)
C87  220n  [C0201]
C88  10n  [C0402]
C89  10n  [C0402]
C90  10n  [C0402]
C91  10n  [C0402]
C92  4u7  [C0402]
C93  220n  [C0201]
R37  22R  [R0402]
R38  0R  [R0402]
R39  0R  [R0402]
R40  0R  [R0402]
R41  191R  [R0201]
U1  MCIMX6Q5EYM10AC_v.ORX  Supplier Part Number 2: MCIMX6QP5EYM1AA  [PBGA624]  (parts D,H,O of 23)

### Ports
ENET_REF_CLK (in, see 15[5B]), RGMII_INT (in, see 15[1C]), RGMII_MDC (out, see 15[1C]), RGMII_MDIO (bidir, see 15[1C]), RGMII_RXCLK (in, see 15[2B]), RGMII_RXD0 (in, see 15[2B]), RGMII_RXD1 (in, see 15[2B]), RGMII_RXD2 (in, see 15[2B]), RGMII_RXD3 (in, see 15[2B]), RGMII_RXDV (in, see 15[2B]), RGMII_TXCLK (out, see 15[2B]), RGMII_TXD0 (out, see 15[2B]), RGMII_TXD1 (out, see 15[2B]), RGMII_TXD2 (out, see 15[2B]), RGMII_TXD3 (out, see 15[2B]), RGMII_TXEN (out, see 15[2B]), SATA_RX_N (in, see 20[4C]), SATA_RX_P (in, see 20[4C]), SATA_TX_N (out, see 20[4D]), SATA_TX_P (out, see 20[4D]), SRC_BOOT_CFG_00 (in, see 24[5A]), SRC_BOOT_CFG_01 (in, see 24[5A]), SRC_BOOT_CFG_02 (in, see 24[5A]), SRC_BOOT_CFG_03 (in, see 24[5A]), SRC_BOOT_CFG_04 (in, see 24[5A]), SRC_BOOT_CFG_05 (in, see 24[5A]), SRC_BOOT_CFG_06 (in, see 24[5A]), SRC_BOOT_CFG_07 (in, see 24[5A]), SRC_BOOT_CFG_08 (in, see 24[5A]), SRC_BOOT_CFG_09 (in, see 24[5A]), SRC_BOOT_CFG_10 (in, see 24[5A]), SRC_BOOT_CFG_11 (in, see 24[5A]), SRC_BOOT_CFG_12 (in, see 24[5A]), SRC_BOOT_CFG_13 (in, see 24[5A]), SRC_BOOT_CFG_14 (in, see 24[5A]), SRC_BOOT_CFG_15 (in, see 24[5A]), SRC_BOOT_CFG_16 (in, see 24[5B]), SRC_BOOT_CFG_17 (in, see 24[5B]), SRC_BOOT_CFG_18 (in, see 24[5B]), SRC_BOOT_CFG_19 (in, see 24[5B]), SRC_BOOT_CFG_20 (in, see 24[5B]), SRC_BOOT_CFG_21 (in, see 24[5B]), SRC_BOOT_CFG_22 (in, see 24[5B]), SRC_BOOT_CFG_23 (in, see 24[5B]), SRC_BOOT_CFG_24 (in, see 24[5B]), SRC_BOOT_CFG_25 (in, see 24[5B]), SRC_BOOT_CFG_26 (in, see 24[5B]), SRC_BOOT_CFG_27 (in, see 24[5B]), SRC_BOOT_CFG_28 (in, see 24[5B]), SRC_BOOT_CFG_29 (in, see 24[5B]), SRC_BOOT_CFG_30 (in, see 24[5B])

### Nets
+1V1_VDDSOC_CAP: R39.1
+2V5: C92.1 R40.1
GND: C87.2 C92.2 C93.2 R41.1
+SATA_VP: C87.1 R39.2 U1.G13(SATA_VP)
+SATA_VPH: C93.1 R40.2 U1.G12(SATA_VPH)
ENET_REF_CLK: U1.V22(ENET_TX_CLK_/_ESAI_RX_FS_/_<GPIO1_IO23>_/_SPDIF_SR_CLK) ; port ENET_REF_CLK
RGMII_INT: R38.2 U1.W22(MLB_SIG_/_ENET_RX_DATA1_/_ESAI_TX_FS_/_ENET_1588_EVENT3_OUT_/_<GPIO1_IO26>) ; port RGMII_INT
RGMII_INT_R: R38.1 U1.V21(ENET_TX_EN_/_ESAI_TX3_RX2_/_<GPIO1_IO28>)
RGMII_MDC: U1.V20(MLB_DATA_/_ENET_MDC_/_ESAI_TX5_RX0_/_ENET_1588_EVENT1_IN_/_<GPIO1_IO31>) ; port RGMII_MDC
RGMII_MDIO: U1.V23(ENET_MDIO_/_ESAI_RX_CLK_/_ENET_1588_EVENT1_OUT_/_<GPIO1_IO22>_/_SPDIF_LOCK) ; port RGMII_MDIO
RGMII_R_TXCLK: R37.1 U1.D21(USB_H2_DATA_/_RGMII_TXC_/_SPDIF_EXT_CLK_/_<GPIO6_IO19>_/_XTALOSC_REF_CLK_24M)
RGMII_RXCLK: U1.B25(USB_H3_STROBE_/_RGMII_RXC_/_<GPIO6_IO30>) ; port RGMII_RXCLK
RGMII_RXD0: U1.C24(HSI_RX_READY_/_RGMII_RD0_/_<GPIO6_IO25>) ; port RGMII_RXD0
RGMII_RXD1: U1.B23(HSI_TX_FLAG_/_RGMII_RD1_/_<GPIO6_IO27>) ; port RGMII_RXD1
RGMII_RXD2: U1.B24(HSI_TX_DATA_/_RGMII_RD2_/_<GPIO6_IO28>) ; port RGMII_RXD2
RGMII_RXD3: U1.D23(HSI_TX_WAKE_/_RGMII_RD3_/_<GPIO6_IO29>) ; port RGMII_RXD3
RGMII_RXDV: U1.D22(USB_H3_DATA_/_RGMII_RX_CTL_/_<GPIO6_IO24>) ; port RGMII_RXDV
RGMII_TXCLK: R37.2 ; port RGMII_TXCLK
RGMII_TXD0: U1.C22(HSI_TX_READY_/_RGMII_TD0_/_<GPIO6_IO20>) ; port RGMII_TXD0
RGMII_TXD1: U1.F20(HSI_RX_FLAG_/_RGMII_TD1_/_<GPIO6_IO21>) ; port RGMII_TXD1
RGMII_TXD2: U1.E21(HSI_RX_DATA_/_RGMII_TD2_/_<GPIO6_IO22>) ; port RGMII_TXD2
RGMII_TXD3: U1.A24(HSI_RX_WAKE_/_RGMII_TD3_/_<GPIO6_IO23>) ; port RGMII_TXD3
RGMII_TXEN: U1.C23(USB_H2_STROBE_/_RGMII_TX_CTL_/_<GPIO6_IO26>_/_ENET_REF_CLK) ; port RGMII_TXEN
SATA_C_RX_N: C88.1 U1.A14(SATA_PHY_RX_N)
SATA_C_RX_P: C89.1 U1.B14(SATA_PHY_RX_P)
SATA_C_TX_N: C90.1 U1.B12(SATA_PHY_TX_N)
SATA_C_TX_P: C91.1 U1.A12(SATA_PHY_TX_P)
SATA_REXT: R41.2 U1.C14(SATA_REXT)
SATA_RX_N: C88.2 ; port SATA_RX_N
SATA_RX_P: C89.2 ; port SATA_RX_P
SATA_TX_N: C90.2 ; port SATA_TX_N
SATA_TX_P: C91.2 ; port SATA_TX_P
SRC_BOOT_CFG_00: U1.L20(<EIM_AD00>_/_IPU1_DISP1_DATA09_/_IPU2_CSI1_DATA09_/_GPIO3_IO00_/_SRC_BOOT_CFG00) ; port SRC_BOOT_CFG_00
SRC_BOOT_CFG_01: U1.J25(<EIM_AD01>_/_IPU1_DISP1_DATA08_/_IPU2_CSI1_DATA08_/_GPIO3_IO01_/_SRC_BOOT_CFG01) ; port SRC_BOOT_CFG_01
SRC_BOOT_CFG_02: U1.L21(<EIM_AD02>_/_IPU1_DISP1_DATA07_/_IPU2_CSI1_DATA07_/_GPIO3_IO02_/_SRC_BOOT_CFG02) ; port SRC_BOOT_CFG_02
SRC_BOOT_CFG_03: U1.K24(<EIM_AD03>_/_IPU1_DISP1_DATA06_/_IPU2_CSI1_DATA06_/_GPIO3_IO03_/_SRC_BOOT_CFG03) ; port SRC_BOOT_CFG_03
SRC_BOOT_CFG_04: U1.L22(<EIM_AD04>_/_IPU1_DISP1_DATA05_/_IPU2_CSI1_DATA05_/_GPIO3_IO04_/_SRC_BOOT_CFG04) ; port SRC_BOOT_CFG_04
SRC_BOOT_CFG_05: U1.L23(<EIM_AD05>_/_IPU1_DISP1_DATA04_/_IPU2_CSI1_DATA04_/_GPIO3_IO05_/_SRC_BOOT_CFG05) ; port SRC_BOOT_CFG_05
SRC_BOOT_CFG_06: U1.K25(<EIM_AD06>_/_IPU1_DISP1_DATA03_/_IPU2_CSI1_DATA03_/_GPIO3_IO06_/_SRC_BOOT_CFG06) ; port SRC_BOOT_CFG_06
SRC_BOOT_CFG_07: U1.L25(<EIM_AD07>_/_IPU1_DISP1_DATA02_/_IPU2_CSI1_DATA02_/_GPIO3_IO07_/_SRC_BOOT_CFG07) ; port SRC_BOOT_CFG_07
SRC_BOOT_CFG_08: U1.L24(<EIM_AD08>_/_IPU1_DISP1_DATA01_/_IPU2_CSI1_DATA01_/_GPIO3_IO08_/_SRC_BOOT_CFG08) ; port SRC_BOOT_CFG_08
SRC_BOOT_CFG_09: U1.M21(<EIM_AD09>_/_IPU1_DISP1_DATA00_/_IPU2_CSI1_DATA00_/_GPIO3_IO09_/_SRC_BOOT_CFG09) ; port SRC_BOOT_CFG_09
SRC_BOOT_CFG_10: U1.M22(<EIM_AD10>_/_IPU1_DI1_PIN15_/_IPU2_CSI1_DATA_EN_/_GPIO3_IO10_/_SRC_BOOT_CFG10) ; port SRC_BOOT_CFG_10
SRC_BOOT_CFG_11: U1.M20(<EIM_AD11>_/_IPU1_DI1_PIN02_/_IPU2_CSI1_HSYNC_/_GPIO3_IO11_/_SRC_BOOT_CFG11) ; port SRC_BOOT_CFG_11
SRC_BOOT_CFG_12: U1.M24(<EIM_AD12>_/_IPU1_DI1_PIN03_/_IPU2_CSI1_VSYNC_/_GPIO3_IO12_/_SRC_BOOT_CFG12) ; port SRC_BOOT_CFG_12
SRC_BOOT_CFG_13: U1.M23(<EIM_AD13>_/_IPU1_DI1_D0_CS_/_GPIO3_IO13_/_SRC_BOOT_CFG13) ; port SRC_BOOT_CFG_13
SRC_BOOT_CFG_14: U1.N23(<EIM_AD14>_/_IPU1_DI1_D1_CS_/_GPIO3_IO14_/_SRC_BOOT_CFG14) ; port SRC_BOOT_CFG_14
SRC_BOOT_CFG_15: U1.N24(<EIM_AD15>_/_IPU1_DI1_PIN01_/_IPU1_DI1_PIN04_/_GPIO3_IO15_/_SRC_BOOT_CFG15) ; port SRC_BOOT_CFG_15
SRC_BOOT_CFG_16: U1.H25(<EIM_ADDR16>_/_IPU1_DI1_DISP_CLK_/_IPU2_CSI1_PIXCLK_/_GPIO2_IO22_/_SRC_BOOT_CFG16) ; port SRC_BOOT_CFG_16
SRC_BOOT_CFG_17: U1.G24(<EIM_ADDR17>_/_IPU1_DISP1_DATA12_/_IPU2_CSI1_DATA12_/_GPIO2_IO21_/_SRC_BOOT_CFG17) ; port SRC_BOOT_CFG_17
SRC_BOOT_CFG_18: U1.J22(<EIM_ADDR18>_/_IPU1_DISP1_DATA13_/_IPU2_CSI1_DATA13_/_GPIO2_IO20_/_SRC_BOOT_CFG18) ; port SRC_BOOT_CFG_18
SRC_BOOT_CFG_19: U1.G25(<EIM_ADDR19>_/_IPU1_DISP1_DATA14_/_IPU2_CSI1_DATA14_/_GPIO2_IO19_/_SRC_BOOT_CFG19) ; port SRC_BOOT_CFG_19
SRC_BOOT_CFG_20: U1.H22(<EIM_ADDR20>_/_IPU1_DISP1_DATA15_/_IPU2_CSI1_DATA15_/_GPIO2_IO18_/_SRC_BOOT_CFG20) ; port SRC_BOOT_CFG_20
SRC_BOOT_CFG_21: U1.H23(<EIM_ADDR21>_/_IPU1_DISP1_DATA16_/_IPU2_CSI1_DATA16_/_GPIO2_IO17_/_SRC_BOOT_CFG21) ; port SRC_BOOT_CFG_21
SRC_BOOT_CFG_22: U1.F24(<EIM_ADDR22>_/_IPU1_DISP1_DATA17_/_IPU2_CSI1_DATA17_/_GPIO2_IO16_/_SRC_BOOT_CFG22) ; port SRC_BOOT_CFG_22
SRC_BOOT_CFG_23: U1.J21(<EIM_ADDR23>_/_IPU1_DISP1_DATA18_/_IPU2_CSI1_DATA18_/_IPU2_SISG3_/_IPU1_SISG3_/_GPIO6_IO06_/_SRC_BOOT_CFG23) ; port SRC_BOOT_CFG_23
SRC_BOOT_CFG_24: U1.F25(<EIM_ADDR24>_/_IPU1_DISP1_DATA19_/_IPU2_CSI1_DATA19_/_IPU2_SISG2_/_IPU1_SISG2_/_GPIO5_IO04_/_SRC_BOOT_CFG24) ; port SRC_BOOT_CFG_24
SRC_BOOT_CFG_25: U1.M25(<EIM_WAIT>_/_EIM_DTACK_B_/_GPIO5_IO00_/_SRC_BOOT_CFG25) ; port SRC_BOOT_CFG_25
SRC_BOOT_CFG_26: U1.K22(<EIM_LBA>_/_IPU1_DI1_PIN17_/_ECSPI2_SS1_/_GPIO2_IO27_/_SRC_BOOT_CFG26) ; port SRC_BOOT_CFG_26
SRC_BOOT_CFG_27: U1.K21(<EIM_EB0>_/_IPU1_DISP1_DATA11_/_IPU2_CSI1_DATA11_/_CCM_PMIC_READY_/_GPIO2_IO28_/_SRC_BOOT_CFG27) ; port SRC_BOOT_CFG_27
SRC_BOOT_CFG_28: U1.K23(<EIM_EB1>_/_IPU1_DISP1_DATA10_/_IPU2_CSI1_DATA10_/_GPIO2_IO29_/_SRC_BOOT_CFG28) ; port SRC_BOOT_CFG_28
SRC_BOOT_CFG_29: U1.K20(<EIM_RW>_/_IPU1_DI1_PIN08_/_ECSPI2_SS0_/_GPIO2_IO26_/_SRC_BOOT_CFG29) ; port SRC_BOOT_CFG_29
SRC_BOOT_CFG_30: U1.E22(EIM_EB2_/_ECSPI1_SS0_/_IPU2_CSI1_DATA19_/_HDMI_TX_DDC_SCL_/_<GPIO2_IO30>_/_I2C2_SCL_/_SRC_BOOT_CFG30) ; port SRC_BOOT_CFG_30

### Layout directives
net class RGMII_MISC: ENET_REF_CLK, RGMII_INT, RGMII_INT_R, RGMII_MDC, RGMII_MDIO
net class RGMII_TXD: RGMII_R_TXCLK, RGMII_TXCLK, RGMII_TXD0, RGMII_TXD1, RGMII_TXD2, RGMII_TXD3, RGMII_TXEN
net class RGMII_RXD: RGMII_RXCLK, RGMII_RXD0, RGMII_RXD1, RGMII_RXD2, RGMII_RXD3, RGMII_RXDV
differential pair; net class DIFF100: SATA_C_RX_N, SATA_C_RX_P, SATA_C_TX_N, SATA_C_TX_P, SATA_RX_N, SATA_RX_P, SATA_TX_N, SATA_TX_P
net class SATA: SATA_C_RX_N, SATA_C_RX_P, SATA_C_TX_N, SATA_C_TX_P, SATA_REXT, SATA_RX_N, SATA_RX_P, SATA_TX_N, SATA_TX_P
net class [06] - ETTHERNET/SATA: (no net found under the mark)

### Notes on the sheet
- CPU - ETHERNET, SATA
- ETHERNET
- DESIGN NOTE:
  If there is a problem with RGMII Interrupt, unfit R88.
- SATA
- (near C87) 11mA
- 13mA
- DESIGN NOTE:
  Feedback from Freescale: For Solo & Dual Lite the SATA_VP and SATA_VPH pins should be powered if performing boundary scan tests.
- DESIGN NOTE:
  SATA Interface is available only in Quad / Dual version of i.MX6 processor.
- Boot Configuration Select
- Variant:
- Checked by
- (in symbol MCIMX6Q5EYM10AC_v.ORX, part D) i.MX6Q - SATA
- (in symbol MCIMX6Q5EYM10AC_v.ORX, part H) i.MX6Q - RGMII
- (in symbol MCIMX6Q5EYM10AC_v.ORX, part O) i.MX6Q - CSI1 / DISP1
- (in symbol SDTitleBlock) Title:; Page Contents:; Revision:; Size:; DWG NO; Date:; Sheet; of

### Library data of the parts
C87 C93 = C0603X5R0J224M030BB: as C59 on sheet [04] - CPU - PCIE, USB; Supplier 1: Digi-Key; Manufacturer Part Number: C0603X5R0J224M030BB; RoHS: RoHS Compliant; Category: Capacitors; Stock 1: 205900; Pricing 1: 1=0.15, 10=0.102, 100=0.0485, 250=0.0408, 500=0.03418, 1000=0.0275, 5000=0.02325 (USD); Packaging: Cut Tape (CT); Tolerance: ±20%; Voltage - Rated: 6.3V; Temperature Coefficient: X5R; Mounting Type: Surface Mount, MLCC; Operating Temperature: -55°C ~ 85°C; Applications: General Purpose; Ratings: -; Package / Case: 0201 (0603 Metric); Size / Dimension: 0.024" L x 0.012" W (0.60mm x 0.30mm); Height - Seated (Max): -; Thickness (Max): 0.013" (0.33mm); Lead Spacing: -; Features: -; Lead Style: -; ComponentLink1URL: http://product.tdk.com/en/catalog/datasheets/mlcc_commercial_general_en.pdf; ComponentLink1Description: http://product.tdk.com/en/catalog/datasheets/mlcc_commercial_general_en.pdf; Supplier Part Number 1: 445-5929-1-ND; .Checked SCH: used; Supplier 2: Digi-Key; Supplier Part Number 2: 1276-1042-6-ND
C88-C91 = C1005X7R1H103K: as C77 on sheet [05] - CPU - HDMI, LVDS; Capacitance: 10000pF; Category: Capacitors; Supplier Part Number: 445-6850-1-ND; Manufacturer Part Number: C1005X7R1H103K; Operating Temperature: -55°C ~ 125°C; Package / Case: 0402 (1005 Metric); Price 1k [$]: 0.01625; .Checked SCH: used; Voltage - Rated: 50V; Supplier: Digikey; Supplier 1: Digi-Key; Supplier Part Number 1: 445-6850-1-ND; RoHS: RoHS Compliant; Stock 1: 3901; Pricing 1: 1=0.2, 10=0.125, 100=0.045, 250=0.03252, 500=0.024, 1000=0.01625 (USD); Tolerance: ±10%; Temperature Coefficient: X7R; Mounting Type: Surface Mount, MLCC; Applications: General Purpose; Ratings: -; Size / Dimension: 0.039" L x 0.020" W (1.00mm x 0.50mm); Height - Seated (Max): -; Thickness (Max): 0.022" (0.55mm); Lead Spacing: -; Features: -; Packaging: Cut Tape (CT); Lead Style: -; ComponentLink1URL: http://www.tdk.co.jp/tefe02/e412_c.pdf; ComponentLink1Description: http://www.tdk.co.jp/tefe02/e412_c.pdf; Supplier 2: Digi-Key; Supplier Part Number 2: 490-4516-6-ND
C92 = C1005X5R1A475M: as C60 on sheet [04] - CPU - PCIE, USB; Supplier 1: Digi-Key; Supplier Part Number 1: 445-8023-1-ND; Manufacturer Part Number: C1005X5R1A475M; RoHS: RoHS Compliant; Category: Capacitors; Stock 1: 10140; Pricing 1: 1=0.53, 10=0.415, 100=0.25, 250=0.18752, 500=0.16, 1000=0.125, 5000=0.095 (USD); Voltage - Rated: 10V; Tolerance: ±20%; Temperature Coefficient: X5R; Mounting Type: Surface Mount, MLCC; Operating Temperature: -55°C ~ 85°C; Applications: General Purpose; Ratings: -; Package / Case: 0402 (1005 Metric); Size / Dimension: 0.039" L x 0.020" W (1.00mm x 0.50mm); Height - Seated (Max): -; Thickness (Max): -; Lead Spacing: -; Features: -; Packaging: Cut Tape (CT); Lead Style: -; ComponentLink1URL: http://www.tdk.com/pdf/general_B11.pdf; ComponentLink1Description: http://www.tdk.com/pdf/general_B11.pdf; .Checked SCH: used
R37 = RC0402FR-0722RL: RES 22.0 OHM 1/16W 1% 0402 SMD; Manufacturer: Yageo; Resistance (Ohms): 22; Power (Watts): 0.063W, 1/16W; .Checked PCB: used; Temperature Coefficient: ±100ppm/°C; Category: Resistors; Supplier Part Number: 311-22.0LRCT-ND; Manufacturer Part Number: RC0402FR-0722RL; Package / Case: 0402 (1005 Metric); Price 1k [$]: 0.01421; Tolerance: ±1%; Value: 22R; .Checked SCH: used; Supplier: Digikey; Supplier 1: Digi-Key; Supplier Part Number 1: 311-22.0LRCT-ND; RoHS: RoHS Compliant; Stock 1: 943800; Pricing 1: 10=0.014, 50=0.0104, 100=0.0079, 250=0.00584, 500=0.00432, 1000=0.00288 (USD); Composition: Thick Film; Features: -; Size / Dimension: 0.039" L x 0.020" W (1.00mm x 0.50mm); Height: 0.016" (0.40mm); Number of Terminations: 2; Packaging: Cut Tape (CT); ComponentLink1URL: http://www.yageo.com/documents/recent/PYu-RC0402_51_RoHS_L_6.pdf; ComponentLink1Description: http://www.yageo.com/documents/recent/PYu-RC0402_51_RoHS_L_6.pdf
R38-R40 = RC0402JR-070RL: as R443 on sheet [17] - LVDS, CSI; Category: Resistors; Supplier Part Number: 311-0.0JRCT-ND; Manufacturer Part Number: RC0402JR-070RL; Package / Case: 0402 (1005 Metric); Price 1k [$]: 0.01389; Value: 0R; .Checked SCH: used; Supplier: Digikey; Supplier 1: Digi-Key; Supplier Part Number 1: 311-0.0JRCT-ND; RoHS: RoHS Compliant; Stock 1: 1106330; Pricing 1: 10=0.012, 50=0.009, 100=0.0069, 250=0.00512, 500=0.0038, 1000=0.00253 (USD); Composition: Thick Film; Features: -; Temperature Coefficient: -; Size / Dimension: 0.039" L x 0.020" W (1.00mm x 0.50mm); Height: 0.016" (0.40mm); Number of Terminations: 2; Packaging: Cut Tape (CT); ComponentLink1URL: http://www.yageo.com/documents/recent/PYu-RC0402_51_RoHS_L_6.pdf; ComponentLink1Description: http://www.yageo.com/documents/recent/PYu-RC0402_51_RoHS_L_6.pdf
R41 = ERJ-1GEF1910C: RES 191 OHM 1/20W 1% 0201 SMD; Manufacturer: Panasonic Electronic Components; Resistance (Ohms): 191; Power (Watts): 0.05W, 1/20W; Temperature Coefficient: ±200ppm/°C; .Creator: MM; .Checked PCB: used; Supplier 1: Digi-Key; Manufacturer Part Number: ERJ-1GEF1910C; RoHS: RoHS Compliant; Category: Resistors; Stock 1: 34157; Pricing 1: 1=0.11, 50=0.0414, 100=0.0315, 250=0.0234, 500=0.01728, 1000=0.01152, 5000=0.0081 (USD); Packaging: Cut Tape (CT); Tolerance: ±1%; Composition: Thick Film; Features: -; Package / Case: 0201 (0603 Metric); Supplier Device Package: 0201; Size / Dimension: 0.024" L x 0.012" W (0.60mm x 0.30mm); Height: 0.010" (0.26mm); Number of Terminations: 2; ComponentLink1URL: http://media.digikey.com/pdf/Data%20Sheets/Panasonic%20Resistors%20Thermistors%20PDFs/ERJ_G,R,E_Rev08.pdf; ComponentLink1Description: http://media.digikey.com/pdf/Data%20Sheets/Panasonic%20Resistors%20Thermistors%20PDFs/ERJ_G,R,E_Rev08.pdf; Supplier Part Number 1: P191ABCT-ND; .Checked SCH: used
U1 = MCIMX6Q5EYM10AC_v.ORX: as U1 on sheet [04] - CPU - PCIE, USB; Supplier 1: Digi-Key; Manufacturer Part Number: MCIMX6Q5EYM10AC; RoHS: RoHS Compliant; Category: Integrated Circuits (ICs); Stock 1: 0; Pricing 1: 1=54.98, 10=51.922, 25=48.868, 100=30.5424 (USD); Packaging: Tray; Package / Case: 624-FBGA, FCBGA; ComponentLink1URL: http://cache.freescale.com/files/32bit/doc/data_sheet/IMX6DQCEC.pdf; ComponentLink1Description: Data Sheet; Supplier Part Number 1: MCIMX6Q5EYM10AC-ND; .Checked SCH: used; Program Memory Size: -; EEPROM Size: -; Data Converters: -; Operating Temperature: -20°C ~ 105°C; ComponentLink2Description: User Guide; ComponentLink2URL: file:///C:/Users/mbeach/Downloads/i.MX_Linux_User's_Guide.pdf; Supplier 2: Arrow